# Altium schematic sheet Controllers.SchDoc
size A; SheetNumber: 1; SheetTotal: 5
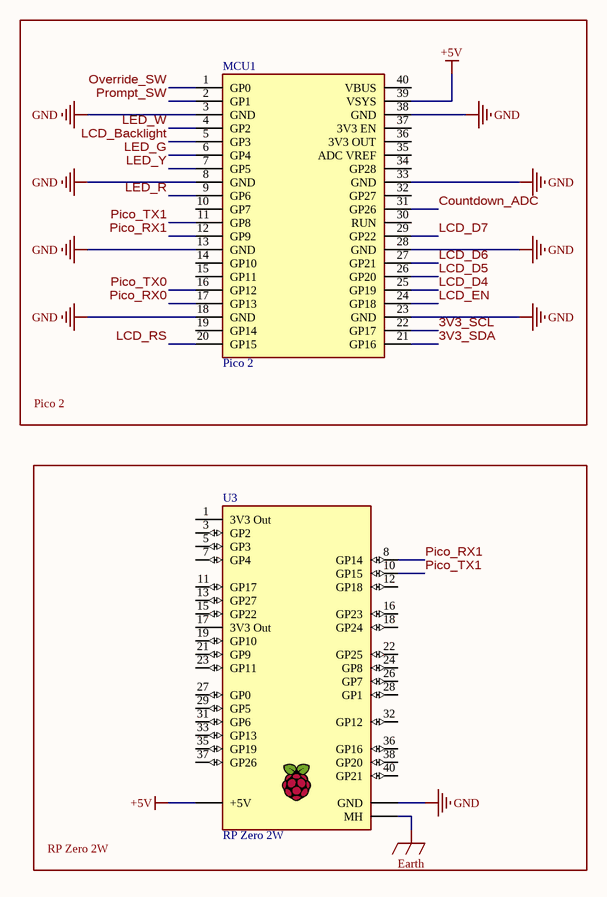
[diagram p0: Controllers.SchDoc]

## Parts
MCU1  Pico 2  [[Pi] Pico 2]
U3  RP Zero 2W  [[Pi] Zero 2W]

## Blocks framed on the sheet
Pico 2: MCU1
RP Zero 2W: U3

## Nets
+5V: MCU1.39(VSYS) U3.+5V
Earth: U3.MH
GND: MCU1.3(GND) MCU1.8(GND) MCU1.13(GND) MCU1.18(GND) MCU1.23(GND) MCU1.28(GND) MCU1.33(GND) MCU1.38(GND) U3.GND
3V3_SCL: MCU1.22(GP17)
3V3_SDA: MCU1.21(GP16)
Countdown_ADC: MCU1.31(GP26)
LCD_Backlight: MCU1.5(GP3)
LCD_D4: MCU1.25(GP19)
LCD_D5: MCU1.26(GP20)
LCD_D6: MCU1.27(GP21)
LCD_D7: MCU1.29(GP22)
LCD_EN: MCU1.24(GP18)
LCD_RS: MCU1.20(GP15)
LED_G: MCU1.6(GP4)
LED_R: MCU1.9(GP6)
LED_W: MCU1.4(GP2)
LED_Y: MCU1.7(GP5)
Override_SW: MCU1.1(GP0)
Pico_RX0: MCU1.17(GP13)
Pico_RX1: MCU1.12(GP9) U3.8(GP14)
Pico_TX0: MCU1.16(GP12)
Pico_TX1: MCU1.11(GP8) U3.10(GP15)
Prompt_SW: MCU1.2(GP1)

Not connected (* = marked no-connect by the designer): MCU1 10(GP7) 14(GP10) 15(GP11) 19(GP14) 30(RUN) 32(GP27) 34(GP28) 35(ADC_VREF) 36(3V3_OUT) 37(3V3_EN) 40(VBUS); U3 1(3V3_Out) 3(GP2) 5(GP3) 7(GP4) 11(GP17) 12(GP18) 13(GP27) 15(GP22) 16(GP23) 17(3V3_Out) 18(GP24) 19(GP10) 21(GP9) 22(GP25) 23(GP11) 24(GP8) 26(GP7) 27(GP0) 28(GP1) 29(GP5) 31(GP6) 32(GP12) 33(GP13) 35(GP19) 36(GP16) 37(GP26) 38(GP20) 40(GP21)

## Library data of the parts
MCU1 = [Pi] Pico 2: SC1631; Supplier 1: DigiKey; Supplier Part Number 1: 2648-SC1631TR-ND
U3 = [Pi] Zero 2W